# EAGLE board Layer 1 (EAGLE 9.6.2), part 1 of 2
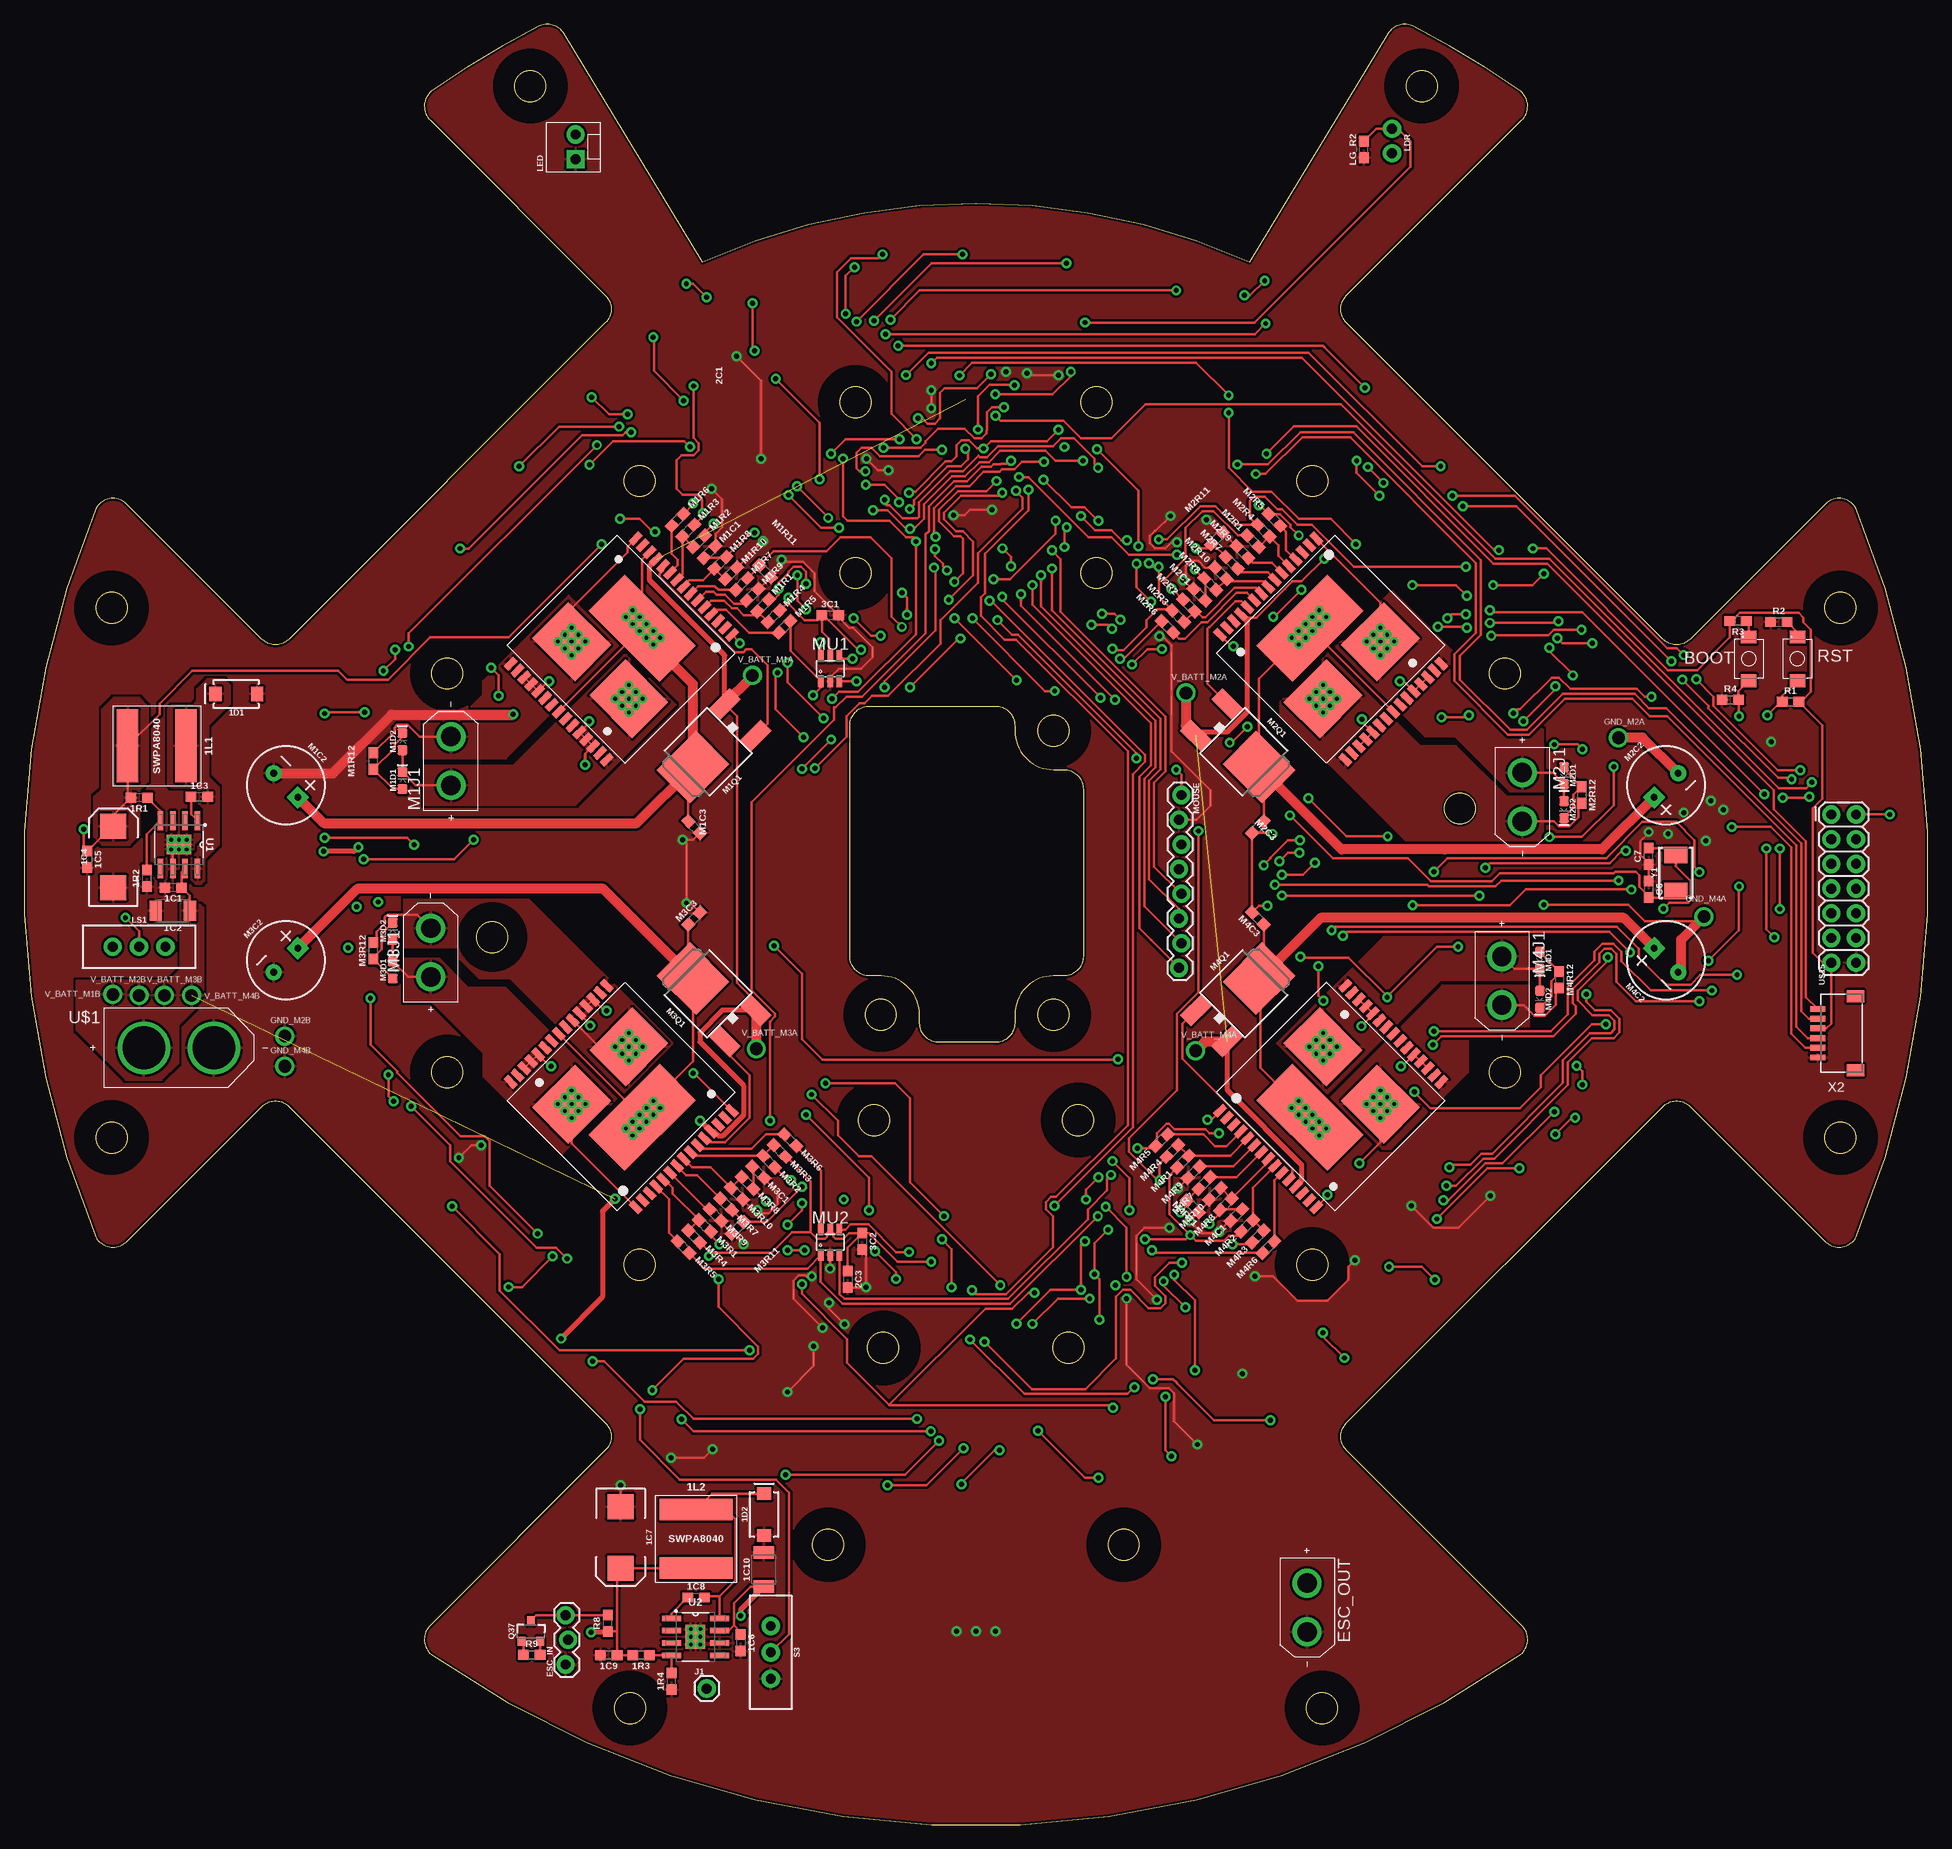
[diagram p5: board, top side]
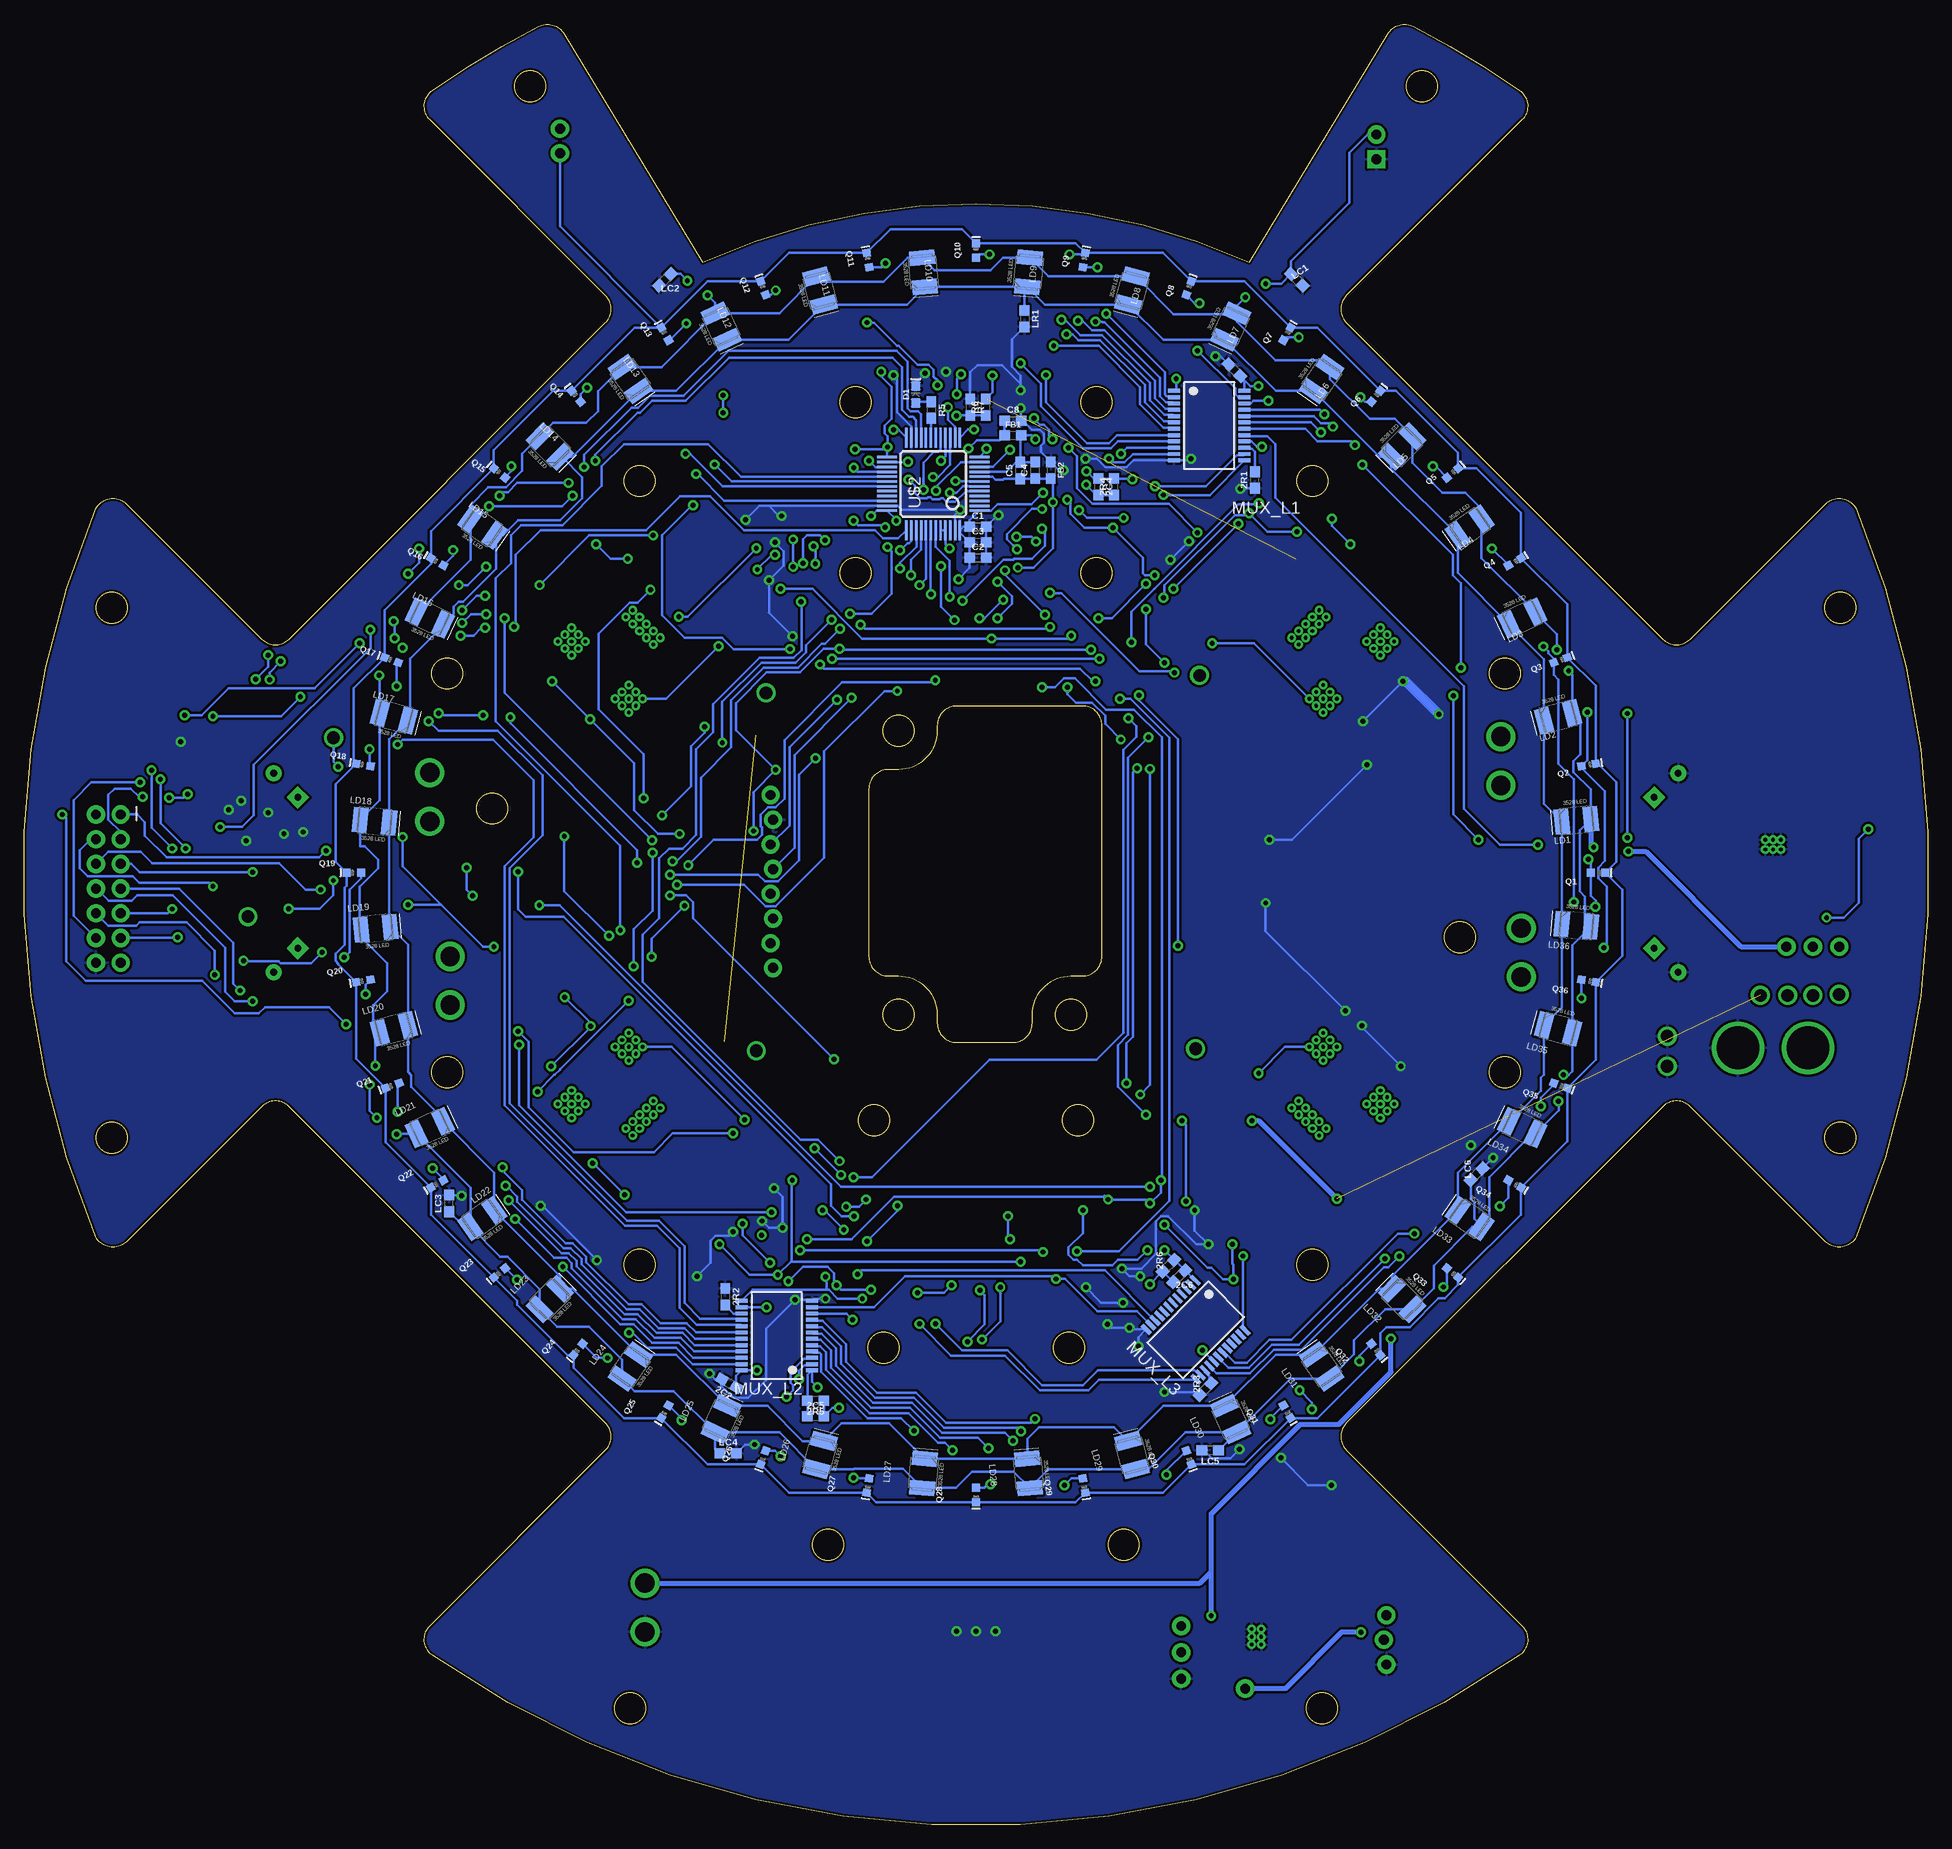
[diagram p6: board, bottom side, seen from below]

Size 195.82 x 185.17 mm. Coordinates in mm from the lower left corner, seen from the top.
Outline: 91 segments
Outline: circle at 186.83,70.65 radius 1.6
Outline: circle at 186.83,125.14 radius 1.6
Outline: circle at 105.9,112.51 radius 1.6
Outline: circle at 105.9,83.3 radius 1.6
Outline: circle at 88.12,83.3 radius 1.6
Outline: circle at 8.99,125.14 radius 1.6
Outline: circle at 8.99,70.65 radius 1.6
Outline: circle at 85.51,146.29 radius 1.6
Outline: circle at 110.31,146.29 radius 1.6
Outline: circle at 63.31,138.2 radius 1.6
Outline: circle at 132.5,138.2 radius 1.6
Outline: circle at 85.51,128.73 radius 1.6
Outline: circle at 110.31,128.73 radius 1.6
Outline: circle at 43.51,118.4 radius 1.6
Outline: circle at 105.9,112.51 radius 1.6
Outline: circle at 152.3,118.4 radius 1.6
Outline: circle at 152.3,77.39 radius 1.6
Outline: circle at 132.5,57.59 radius 1.6
Outline: circle at 87.41,72.45 radius 1.6
Outline: circle at 43.51,77.39 radius 1.6
Copper layers (1*16): Top 0.035mm / dielectric 1.5mm / Bottom 0.035mm
Design rules "SparkFun-2-layer-STANDARD": minimum track width 10mil, minimum drill 20mil, track to track 10mil, track to pad 8mil, pad to pad 8mil, via to via 10mil, smd to smd 8mil, copper to edge 8mil, drill to drill 8mil, minimum pad ring 10mil, minimum via ring 10mil, stop-mask expansion 4mil, vias tented up to drill 25mil, thermal gap 10mil
tRestrict: area 48.6,175.3 to 55.6,182.3; area 140.3,175.3 to 147.3,182.3; area 183.3,121.6 to 190.3,128.6; area 183.3,67.1 to 190.3,74.1; area 5.5,121.6 to 12.5,128.6; area 5.5,67.1 to 12.5,74.1; area 130,8.5 to 137,15.5; area 58.8,8.5 to 65.8,15.5; area 79.2,25.3 to 86.2,32.3; area 109.6,25.3 to 116.6,32.3; area 82,142.8 to 89,149.8; area 106.8,142.8 to 113.8,149.8; 18 more areas

## Footprints (pad centres in the part's own frame; a part is rotated, then mirrored left to right if it is on the bottom)
C0603 = smd 1.1 x 1: 1 -0.85,0; 2 0.85,0
C1210 = smd 1.27 x 2.06: 1 -1.755,0; 2 1.755,0
EIA7343 = smd 2.55 x 2.7: A 3.17,0; C -3.17,0
SMA-DIODE = smd 1.27 x 1.47: A -2.15,0; C 2.15,0
SWPA8040 = smd 2.2 x 7.5: P1 -3,0; P2 3,0
R0603 = smd 1.1 x 1: 1 -0.85,0; 2 0.85,0
MOMENTARY_SWITCH_4X3 = smd 1.3 x 1.6: P$1 -2.25,0; P$2 2.25,0
LED-0603 = smd 1 x 1: A -0.877,0; C 0.877,0
1X03_LOCK = drill 1.016 pad 1.88: 1 0,0.127; 2 2.54,-0.127; 3 5.08,0.127
XT30PB-F = drill 2: + -2.5,0; - 2.5,0
0603 = smd 1.1 x 1: 1 -0.85,0; 2 0.85,0
18AWG = drill 1.3: P$1 0,0
1X01 = drill 1.016 pad 1.88: 1 0,0
3528 = smd 1.5 x 2.6: A -1.5,0; C 1.5,0
1X02_NO_SILK = drill 1.016 pad 1.88: 1 0,0; 2 2.54,0
MOLEX-1X2 = drill 1.016 pad 1.88 square: 1 0,0 | drill 1.016 pad 1.88: 2 2.54,0
SWITCH_SPDT_PTH_11.6X4.0MM_LOCK = drill 1.016 pad 1.88: 1 0,2.718; 2 0,0; 3 0,-2.718
3.5MM_CAP = drill 0.7 pad 1.651 square: 1 1.75,0 | drill 0.7 pad 1.651: 2 -1.75,0
DPAK = smd 1.6 x 3: 1 -2.28,-5.31; 3 2.28,-5.31 | smd 4.826 x 5.715: 4 0,1.588
POWERSO-30 = smd 0.65 x 1.4: P1 -7,-9.1; P2 -6,-9.1; P3 -5,-9.1; P4 -4,-9.1; P5 -3,-9.1; P6 -2,-9.1; P7 -1,-9.1; P8 0,-9.1; P9 1,-9.1; P10 2,-9.1; P11 3,-9.1; P12 4,-9.1; P13 5,-9.1; P14 6,-9.1; P15 7,-9.1; P16 7,9.1; P17 6,9.1; P18 5,9.1; P19 4,9.1; P20 3,9.1; P21 2,9.1; P22 1,9.1; P23 0,9.1; P24 -1,9.1; P25 -2,9.1; P26 -3,9.1; P27 -4,9.1; P28 -5,9.1; P29 -6,9.1; P30 -7,9.1 | drill 0.381: P$1 -4.165,3.05; P$2 -3.165,3.05; P$3 -5.165,3.05; P$4 -5.165,2.05; P$5 -4.165,2.05; P$6 -3.165,2.05; P$7 -5.165,4.05; P$8 -4.165,4.05; P$9 -3.165,4.05; P$10 4.165,3.05; P$11 5.165,3.05; P$12 3.165,3.05; P$13 3.165,2.05; P$14 4.165,2.05; P$15 5.165,2.05; P$16 3.165,4.05; P$17 4.165,4.05; P$18 5.165,4.05; P$19 0,-2.669; P$20 -1,-2.669; P$21 1,-2.669; P$22 -2,-2.669; P$23 2,-2.669; P$24 0,-3.669; P$25 1,-3.669; P$26 2,-3.669; P$27 -1,-3.669; P$28 -2,-3.669 | smd 10.3 x 5.25: SLUG1 0,-3.05 | smd 6.23 x 5.25: SLUG2 -4.165,3.05; SLUG3 4.165,3.05
1X08_LOCK = drill 1.016 pad 1.88: 1 0,0.127; 2 2.54,-0.127; 3 5.08,0.127; 4 7.62,-0.127; 5 10.16,0.127; 6 12.7,-0.127; 7 15.24,0.127; 8 17.78,-0.127
SOT23-6 = smd 0.55 x 1.2: 1 -0.95,-1.3; 2 0,-1.3; 3 0.95,-1.3; 4 0.95,1.3; 5 0,1.3; 6 -0.95,1.3
SSOP24 = smd 0.4 x 1.25: 1 -3.575,-3.625; 2 -2.925,-3.625; 3 -2.275,-3.625; 4 -1.625,-3.625; 5 -0.975,-3.625; 6 -0.325,-3.625; 7 0.325,-3.625; 8 0.975,-3.625; 9 1.625,-3.625; 10 2.275,-3.625; 11 2.925,-3.625; 12 3.575,-3.625; 13 3.575,3.625; 14 2.925,3.625; 15 2.275,3.625; 16 1.625,3.625; 17 0.975,3.625; 18 0.325,3.625; 19 -0.325,3.625; 20 -0.975,3.625; 21 -1.625,3.625; 22 -2.275,3.625; 23 -2.925,3.625; 24 -3.575,3.625
ALS-PT19 = smd 0.8 x 0.8: C -0.75,0; E 0.75,0
SOT23-3 = smd 0.8 x 0.9: 1 -0.95,-1; 2 0.95,-1; 3 0,1.1
POWERPAD-SOIC-8 = smd 1.981 x 0.559: 1 -2.464,1.905; 2 -2.464,0.635; 3 -2.464,-0.635; 4 -2.464,-1.905; 5 2.464,-1.905; 6 2.464,-0.635; 7 2.464,0.635; 8 2.464,1.905 | smd 2.007 x 2.489: 9 0,0 | drill 0.381: P$1 -0.5,0.8; P$2 0.5,0.8; P$3 -0.5,0; P$4 0.5,0; P$5 -0.5,-0.8; P$6 0.5,-0.8
XT60PB-M = drill 4.4: + -3.6,0; - 3.6,0
LQFP48 = smd 0.254 x 2.032: 1 -2.75,-4.758; 2 -2.25,-4.758; 3 -1.75,-4.758; 4 -1.25,-4.758; 5 -0.75,-4.758; 6 -0.25,-4.758; 7 0.25,-4.758; 8 0.75,-4.758; 9 1.25,-4.758; 10 1.75,-4.758; 11 2.25,-4.758; 12 2.75,-4.758; 25 2.75,4.758; 26 2.25,4.758; 27 1.75,4.758; 28 1.25,4.758; 29 0.75,4.758; 30 0.25,4.758; 31 -0.25,4.758; 32 -0.75,4.758; 33 -1.25,4.758; 34 -1.75,4.758; 35 -2.25,4.758; 36 -2.75,4.758 | smd 2.032 x 0.254: 13 4.758,-2.75; 14 4.758,-2.25; 15 4.758,-1.75; 16 4.758,-1.25; 17 4.758,-0.75; 18 4.758,-0.25; 19 4.758,0.25; 20 4.758,0.75; 21 4.758,1.25; 22 4.758,1.75; 23 4.758,2.25; 24 4.758,2.75; 37 -4.758,2.75; 38 -4.758,2.25; 39 -4.758,1.75; 40 -4.758,1.25; 41 -4.758,0.75; 42 -4.758,0.25; 43 -4.758,-0.25; 44 -4.758,-0.75; 45 -4.758,-1.25; 46 -4.758,-1.75; 47 -4.758,-2.25; 48 -4.758,-2.75
2X7 = drill 1.016 pad 1.88: 1 0,0; 2 0,2.54; 3 2.54,0; 4 2.54,2.54; 5 5.08,0; 6 5.08,2.54; 7 7.62,0; 8 7.62,2.54; 9 10.16,0; 10 10.16,2.54; 11 12.7,0; 12 12.7,2.54; 13 15.24,0; 14 15.24,2.54
SM06B-SRSS-TB = smd 0.6 x 1.55: 1 2.5,0; 2 1.5,0; 3 0.5,0; 4 -0.5,0; 5 -1.5,0; 6 -2.5,0 | smd 1.2 x 1.8: M1 3.8,3.875; M2 -3.8,3.875
CRYSTAL-SMD-5X3.2-2PAD = smd 1.7 x 2.4: P$1 1.85,0; P$2 -1.85,0

## Placement (x,y rotation side)
1C1  4.7uF  [C0603]  15.33,96.37 180 top
1C2  22uF  [C1210]  15.28,93.98 180 top
1C3  10nF  [C0603]  18.01,105.73 0 top
1C4  220uF  [EIA7343]  9.16,99.52 90 top
1C5  0.1uF  [C0603]  6.48,99.28 270 top
1C6  4.7uF  [C0603]  73.7,18.69 270 top
1C7  220uF  [EIA7343]  61.35,29.53 270 top
1C8  10nF  [C0603]  69.11,23.36 0 top
1C9  0.1uF  [C0603]  60.13,17.42 180 top
1C10  22uF  [C1210]  76.08,26.23 90 top
1D1  SS54  [SMA-DIODE]  21.81,116.29 180 top
1D2  SS54  [SMA-DIODE]  76.11,31.89 90 top
1L1  10uH  [SWPA8040]  13.63,110.94 180 top
1L2  10uH  [SWPA8040]  69.11,29.39 270 top
1R1  10k  [R0603]  11.81,105.62 180 top
1R2  5.9k  [R0603]  12.62,97.34 90 top
1R3  10k  [R0603]  63.45,17.42 180 top
1R4  3.24k  [R0603]  66.59,14.73 90 top
2C1  0.1uF  [C0603]  71.31,149.59 135 bottom
2C2  0.1uF  [C0603]  123.31,45.39 150 bottom
2C3  0.1uF  [C0603]  84.71,56.09 270 top
2C4  1uF  [C0603]  85.31,137.59 270 bottom
2C5  1uF  [C0603]  114.41,41.99 0 bottom
2C6  1uF  [C0603]  77.01,56.39 225 bottom
2R1  1k  [R0603]  69.21,138.29 90 bottom
2R2  1k  [R0603]  123.71,54.29 270 bottom
2R3  1k  [R0603]  74.31,44.79 45 bottom
2R4  3k  [R0603]  83.71,137.59 90 bottom
2R5  3k  [R0603]  114.41,43.59 180 bottom
2R6  3k  [R0603]  78.11,57.49 45 bottom
3C1  0.1uF  [C0603]  82.91,124.39 0 top
3C2  0.1uF  [C0603]  86.21,59.99 270 top
BOOT  MOMENTARY_SWITCH_4X3  [MOMENTARY_SWITCH_4X3]  177.41,119.89 270 top
C1  1uF  [C0603]  97.71,133.49 0 bottom
C2  1uF  [C0603]  97.71,130.29 0 bottom
C3  1uF  [C0603]  97.71,131.89 0 bottom
C4  10nF  [C0603]  91.81,139.29 90 bottom
C5  1uF  [C0603]  93.35,139.27 90 bottom
C6  22pF  [C0603]  167.11,96.19 270 top
C7  22pF  [C0603]  167.11,99.59 90 top
C8  1uF  [C0603]  94.11,144.39 0 bottom
D1  BLUE  [LED-0603]  104.11,147.09 90 bottom
ESC_IN  [1X03_LOCK]  55.81,16.46 90 top
ESC_OUT  XT30PB-F  [XT30PB-F]  131.97,22.33 270 top
FB1  30Ω/1.8A  [0603]  94.11,142.89 0 bottom
FB2  30Ω/1.8A  [0603]  90.21,139.29 270 bottom
GND_M2A  18AWG  [18AWG]  164.01,111.79 0 top
GND_M2B  18AWG  [18AWG]  26.81,81.09 0 top
GND_M4A  18AWG  [18AWG]  172.81,93.39 0 top
GND_M4B  18AWG  [18AWG]  26.81,77.99 0 top
J1  [1X01]  70.21,13.99 0 top
LC1  1uF  [C0603]  64.91,158.89 315 bottom
LC2  1uF  [C0603]  129.91,158.89 225 bottom
LC3  1uF  [C0603]  152.11,63.89 90 bottom
LC4  1uF  [C0603]  123.41,38.19 0 bottom
LC5  1uF  [C0603]  73.81,38.49 180 bottom
LC6  1uF  [C0603]  46.41,66.89 45 bottom
LD1  3528LED  [3528]  36.14,103.3 185 bottom
LD2  3528LED  [3528]  38.02,113.94 195 bottom
LD3  3528LED  [3528]  41.72,124.1 205 bottom
LD4  3528LED  [3528]  47.12,133.46 215 bottom
LD5  3528LED  [3528]  54.07,141.73 225 bottom
LD6  3528LED  [3528]  62.35,148.68 235 bottom
LD7  3528LED  [3528]  71.71,154.09 245 bottom
LD8  3528LED  [3528]  81.86,157.78 255 bottom
LD9  3528LED  [3528]  92.5,159.66 265 bottom
LD10  3528LED  [3528]  103.31,159.66 275 bottom
LD11  3528LED  [3528]  113.96,157.78 285 bottom
LD12  3528LED  [3528]  124.11,154.09 295 bottom
LD13  3528LED  [3528]  133.47,148.68 305 bottom
LD14  3528LED  [3528]  141.75,141.73 315 bottom
LD15  3528LED  [3528]  148.7,133.46 325 bottom
LD16  3528LED  [3528]  154.1,124.1 335 bottom
LD17  3528LED  [3528]  157.8,113.94 345 bottom
LD18  3528LED  [3528]  159.77,103.2 355 bottom
LD19  3528LED  [3528]  159.67,92.19 5 bottom
LD20  3528LED  [3528]  157.8,81.85 15 bottom
LD21  3528LED  [3528]  154.1,71.69 25 bottom
LD22  3528LED  [3528]  148.7,62.33 35 bottom
LD23  3528LED  [3528]  141.75,54.05 45 bottom
LD24  3528LED  [3528]  133.47,47.11 55 bottom
LD25  3528LED  [3528]  124.11,41.7 65 bottom
LD26  3528LED  [3528]  113.96,38.01 75 bottom
LD27  3528LED  [3528]  103.31,36.13 85 bottom
LD28  3528LED  [3528]  92.5,36.13 95 bottom
LD29  3528LED  [3528]  81.86,38.01 105 bottom
LD30  3528LED  [3528]  71.71,41.7 115 bottom
LD31  3528LED  [3528]  62.35,47.11 125 bottom
LD32  3528LED  [3528]  54.07,54.05 135 bottom
LD33  3528LED  [3528]  47.12,62.33 145 bottom
LD34  3528LED  [3528]  41.72,71.69 155 bottom
LD35  3528LED  [3528]  38.02,81.85 165 bottom
LD36  3528LED  [3528]  36.14,92.49 175 bottom
LDR  [1X02_NO_SILK]  140.71,171.89 90 top
LED  [MOLEX-1X2]  56.71,171.29 90 top
LG_R2  2k  [R0603]  137.81,172.29 90 top
LR1  47  [R0603]  92.91,154.89 270 bottom
LS1  [SWITCH_SPDT_PTH_11.6X4.0MM_LOCK]  11.81,90.29 270 top
M1C1  33nF  [C0603]  70.51,130.89 45 top
M1C2  680uF  [3.5MM_CAP]  26.91,106.89 315 top
M1C3  1.0uF  [C0603]  68.91,102.59 315 top
M1D1  RED  [LED-0603]  38.91,107.39 90 top
M1D2  BLUE  [LED-0603]  38.91,111.39 90 top
M1J1  XT30PB-F  [XT30PB-F]  43.91,109.39 90 top
M1Q1  AOD482  [DPAK]  69.91,109.89 135 top
M1R1  1k  [R0603]  76.01,125.39 225 top
M1R2  1k  [R0603]  69.41,131.99 225 top
M1R3  3.3k  [R0603]  68.31,133.09 45 top
M1R4  3.3k  [R0603]  77.11,124.29 45 top
M1R5  1k  [R0603]  78.21,123.19 225 top
M1R6  1k  [R0603]  67.21,134.19 225 top
M1R7  1k  [R0603]  73.81,127.59 225 top
M1R8  10k  [R0603]  71.61,129.79 225 top
M1R9  10k  [R0603]  74.91,126.49 225 top
M1R10  1k  [R0603]  72.71,128.69 225 top
M1R11  10k  [R0603]  76.21,128.89 135 top
M1R12  4.7k  [R0603]  35.91,109.39 90 top
M2C1  33nF  [C0603]  120.91,126.49 135 top
M2C2  680uF  [3.5MM_CAP]  168.91,106.89 225 top
M2C3  1.0uF  [C0603]  126.91,102.59 225 top
M2D1  RED  [LED-0603]  158.41,107.89 270 top
M2D2  BLUE  [LED-0603]  158.41,104.39 270 top
M2J1  XT30PB-F  [XT30PB-F]  154.11,105.69 270 top
M2Q1  AOD482  [DPAK]  125.91,109.89 225 top
M2R1  1k  [R0603]  126.41,131.99 315 top
M2R2  1k  [R0603]  119.81,125.39 315 top
M2R3  3.3k  [R0603]  118.71,124.29 135 top
M2R4  3.3k  [R0603]  127.51,133.09 135 top
M2R5  1k  [R0603]  128.61,134.19 315 top
M2R6  1k  [R0603]  117.61,123.19 315 top
M2R7  1k  [R0603]  124.21,129.79 315 top
M2R8  10k  [R0603]  122.01,127.59 315 top
M2R9  10k  [R0603]  125.31,130.89 315 top
M2R10  1k  [R0603]  123.11,128.69 315 top
M2R11  10k  [R0603]  122.71,132.29 225 top
M2R12  4.7k  [R0603]  160.21,105.89 270 top
M3C1  33nF  [C0603]  75.51,67.09 315 top
M3C2  680uF  [3.5MM_CAP]  26.91,88.89 45 top
M3C3  1.0uF  [C0603]  68.91,93.19 45 top
M3D1  RED  [LED-0603]  37.91,87.89 90 top
M3D2  BLUE  [LED-0603]  37.91,91.89 90 top
M3J1  XT30PB-F  [XT30PB-F]  41.81,89.69 90 top
M3Q1  AOD482  [DPAK]  69.91,85.89 45 top
M3R1  1k  [R0603]  70.01,61.59 135 top
M3R2  1k  [R0603]  76.61,68.19 135 top
M3R3  3.3k  [R0603]  77.71,69.29 315 top
M3R4  3.3k  [R0603]  68.91,60.49 315 top
M3R5  1k  [R0603]  67.81,59.39 135 top
M3R6  1k  [R0603]  78.81,70.39 135 top
M3R7  1k  [R0603]  72.21,63.79 135 top
M3R8  10k  [R0603]  74.41,65.99 135 top
M3R9  10k  [R0603]  71.11,62.69 135 top
M3R10  1k  [R0603]  73.31,64.89 135 top
M3R11  10k  [R0603]  73.41,61.39 45 top
M3R12  4.7k  [R0603]  35.91,89.89 90 top
M4C1  33nF  [C0603]  124.71,62.69 225 top
M4C2  680uF  [3.5MM_CAP]  168.91,88.89 135 top
M4C3  1.0uF  [C0603]  126.91,93.19 135 top
M4D1  RED  [LED-0603]  155.91,88.89 270 top
M4D2  BLUE  [LED-0603]  155.91,84.89 270 top
M4J1  XT30PB-F  [XT30PB-F]  152.01,86.79 270 top
M4Q1  AOD482  [DPAK]  125.91,85.89 315 top
M4R1  1k  [R0603]  119.21,68.19 45 top
M4R2  1k  [R0603]  125.81,61.59 45 top
M4R3  3.3k  [R0603]  126.91,60.49 225 top
M4R4  3.3k  [R0603]  118.11,69.29 225 top
M4R5  1k  [R0603]  117.01,70.39 45 top
M4R6  1k  [R0603]  128.01,59.39 45 top
M4R7  1k  [R0603]  121.41,65.99 45 top
M4R8  10k  [R0603]  123.61,63.79 45 top
M4R9  10k  [R0603]  120.31,67.09 45 top
M4R10  1k  [R0603]  122.51,64.89 45 top
M4R11  10k  [R0603]  120.21,63.59 135 top
M4R12  4.7k  [R0603]  157.91,86.89 270 top
M_BL  VNH5019  [POWERSO-30]  61.41,74.89 45 top
M_BR  VNH5019  [POWERSO-30]  134.41,74.89 315 top
M_FL  VNH5019  [POWERSO-30]  61.41,120.89 135 top
M_FR  VNH5019  [POWERSO-30]  134.41,120.89 225 top
MOUSE  [1X08_LOCK]  118.91,105.89 270 top
MU1  [SOT23-6]  82.91,118.89 0 top
MU2  [SOT23-6]  82.91,59.89 0 top
MUX_L1  [SSOP24]  73.91,143.89 270 bottom
MUX_L2  [SSOP24]  118.41,50.29 90 bottom
MUX_L3  [SSOP24]  75.31,50.89 225 bottom
Q1  [ALS-PT19]  33.91,97.89 180 bottom
Q2  [ALS-PT19]  34.88,109.01 190 bottom
Q3  [ALS-PT19]  37.77,119.78 200 bottom
Q4  [ALS-PT19]  42.48,129.89 210 bottom
Q5  [ALS-PT19]  48.88,139.03 220 bottom
Q6  [ALS-PT19]  56.77,146.92 230 bottom
Q7  [ALS-PT19]  65.91,153.32 240 bottom
Q8  [ALS-PT19]  76.02,158.03 250 bottom
Q9  [ALS-PT19]  86.79,160.92 260 bottom
Q10  [ALS-PT19]  97.91,161.89 270 bottom
Q11  [ALS-PT19]  109.02,160.92 280 bottom
Q12  [ALS-PT19]  119.8,158.03 290 bottom
Q13  [ALS-PT19]  129.91,153.32 300 bottom
Q14  [ALS-PT19]  139.05,146.92 310 bottom
Q15  [ALS-PT19]  146.94,139.03 320 bottom
Q16  [ALS-PT19]  153.33,129.89 330 bottom
Q17  [ALS-PT19]  158.05,119.78 340 bottom
Q18  [ALS-PT19]  160.94,109.01 350 bottom
Q19  [ALS-PT19]  161.91,97.89 0 bottom
Q20  [ALS-PT19]  160.94,86.78 10 bottom
Q21  [ALS-PT19]  157.95,76 20 bottom
Q22  [ALS-PT19]  153.33,65.89 30 bottom
Q23  [ALS-PT19]  146.94,56.76 40 bottom
Q24  [ALS-PT19]  138.85,48.87 50 bottom
Q25  [ALS-PT19]  129.91,42.47 60 bottom
Q26  [ALS-PT19]  119.8,37.75 70 bottom
Q27  [ALS-PT19]  109.02,34.87 80 bottom
Q28  [ALS-PT19]  97.91,33.89 90 bottom
Q29  [ALS-PT19]  86.79,34.87 100 bottom
Q30  [ALS-PT19]  76.02,37.75 110 bottom
Q31  [ALS-PT19]  65.91,42.47 120 bottom
Q32  [ALS-PT19]  56.77,48.87 130 bottom
Q33  [ALS-PT19]  48.88,56.76 140 bottom
Q34  [ALS-PT19]  42.48,65.89 150 bottom
Q35  [ALS-PT19]  37.77,76 160 bottom
Q36  [ALS-PT19]  34.88,86.78 170 bottom
Q37  AO3402  [SOT23-3]  52.11,19.86 0 top
R1  10k  [R0603]  181.71,115.49 0 top
R2  1k  [R0603]  180.51,123.69 0 top
R3  1k  [R0603]  176.31,123.79 180 top
R4  10k  [R0603]  175.51,115.69 0 top
R5  470  [R0603]  102.51,145.49 270 bottom
R6  2M  [R0603]  96.91,145.79 90 bottom
R7  500k  [R0603]  98.51,145.79 270 bottom
R8  4.7k  [R0603]  60.03,20.71 90 top
R9  4.7k  [R0603]  52.21,17.46 0 top
RST  MOMENTARY_SWITCH_4X3  [MOMENTARY_SWITCH_4X3]  182.41,119.89 270 top
S3  [SWITCH_SPDT_PTH_11.6X4.0MM_LOCK]  76.8,17.71 180 top
U1  [POWERPAD-SOIC-8]  15.91,100.79 270 top
U2  [POWERPAD-SOIC-8]  69.06,19.31 0 top
U$1  XT60XT60PB-M  [XT60PB-M]  15.91,79.89 0 top
U$2  STM32F103CBT6  [LQFP48]  102.31,137.89 90 bottom
U$15  CONN_07X2  [2X7]  185.91,103.89 270 top
V_BATT_M1A  18AWG  [18AWG]  74.91,118.19 0 top
V_BATT_M1B  18AWG  [18AWG]  9.11,85.39 0 top
V_BATT_M2A  18AWG  [18AWG]  119.51,116.39 0 top
V_BATT_M2B  18AWG  [18AWG]  11.81,85.29 0 top
V_BATT_M3A  18AWG  [18AWG]  75.31,79.79 0 top
V_BATT_M3B  18AWG  [18AWG]  14.41,85.29 0 top
V_BATT_M4A  18AWG  [18AWG]  120.51,79.59 0 top
V_BATT_M4B  18AWG  [18AWG]  17.21,85.29 0 top
X2  SM06B-SRSS-TB  [SM06B-SRSS-TB]  184.51,81.39 270 top
Y1  8MHz  [CRYSTAL-SMD-5X3.2-2PAD]  169.91,97.89 90 top

## Tracks (layer width: path | path; a pad name or v marks a point on that pad's centre or on a via)
3.3V  (via drill 0.51)
  Top 0.254: 80.91,60.9 81.55,60.26 82.37,60.26 82.56,60.46 82.56,60.85 MU2.5 83.25,60.85 83.25,60.46 83.45,60.26 84.27,60.26 84.85,60.84 3C2.1 | 80.91,60.9 80.91,66.19 78.41,68.69 M3R3.2 | M1R3.2 69.81,134.59 v69.81,134.89 69.71,134.99 69.71,136.25 69.18,136.78 67.72,136.78 67.13,137.37 67.13,140.35 67.61,140.83 68.85,140.83 69.37,141.35 69.37,142.09 68.84,142.63 v68.84,147.96 | M1R4.2 78.61,125.79 v78.61,126.19 78.61,125.54 80.26,123.89 81.56,123.89 3C1.1 82.06,124.29 | 82.06,124.29 82.06,122.7 82.8,121.96 82.8,120.31 MU1.5 | v6.11,102.39 6.11,100.51 1C5.1 9.04,102.69 1C4.A 9.16,103.81 1R1.2 10.63,105.95 1L1.P2 13.91,114.22 13.91,115.29 17.29,118.67 32.31,118.67 33.21,117.77 37.41,117.77 41.74,122.1 49.82,122.1 v59.41,131.69 | 82.06,124.29 82.34,124.29 85.93,120.7 v86.07,120.83 | 113.08,120.78 115.43,123.14 115.43,123.87 116.56,125 118.01,125 M2R3.2 116.71,126.29 v116.71,129.39 116.04,129.39 v115.71,129.72 | LS1.2 11.81,91.89 v10.41,93.29 | v111.96,120.94 112.12,120.78 113.08,120.78 | 2C3.1 84.71,59.34 3C2.1 | 3C2.1 86.91,60.84 89.85,57.9 v93.31,57.9 | M4R4.2 116.81,67.99 v116.81,66.28 116.56,66.28 113.64,69.2 113.64,70.61 118.59,75.55 118.59,83.39 120.81,85.62 v120.81,102.19 | M4R3.2 126.1,59.68 v124.31,59.68 | M3R4.2 70.42,58.98 v70.42,58.48 70.75,58.81 76.88,58.81 78.97,60.9 80.91,60.9 | v61.31,134.32 63.31,134.32 64.64,132.99 v64.91,132.99 | v120.42,46.72 120.42,53.94 118.3,56.06 v118.3,56.55 | v106.11,134.09 106.11,132.79 101.41,128.09 v99.72,128.09 | v116.71,132.18 117.58,132.18 121,135.6 122.57,135.6 124.47,133.7 M2R4.2 126.81,133.7 126.11,134.39 126.11,136.15 126.54,136.58 127.62,136.58 128.9,135.3 129.39,135.3 131,133.7 132.49,133.7 136.79,129.39 v148.31,129.39
  Top 0.254: v155.19,131.25 156.57,131.25 169.07,118.75 172.11,118.75 175.46,122.1 R3.2 175.64,123.79 176.47,124.62 182.55,124.62 183.04,124.13 183.04,123.66 183.81,122.89 183.81,116.49 182.81,115.49 R1.2 185,113.06 185,105.53 184.01,104.54 184.01,89.69 185.05,88.65 U$15.13 185.91,82.39 185.41,81.89 X2.4 | v156.31,128.64 155.16,127.49 v151.11,127.49 | v118.51,108.49 119.04,107.97 MOUSE.1 | v113.42,132.11 112.89,132.11 111.85,133.14 110.16,133.14 v108.71,134.59 | 113.08,120.78 | v106.41,143.47 105.24,142.3 99.43,142.3 v98.67,141.54 98.02,141.54 97.18,142.38 96.44,142.38 95.92,141.86 95.92,140.72 95.41,140.21 94.79,140.21 91.67,137.09 91.11,137.09 v91.01,136.99
  Bottom 0.254: v78.61,126.19 78.5,126.31 78.5,127.46 71.28,134.68 70.02,134.68 v69.81,134.89 67.91,132.99 v64.91,132.99 | v6.11,102.39 7.11,101.39 7.11,94.79 8.61,93.29 v10.41,93.29 | MUX_L1.24 70.31,147.49 70.31,148.29 70.71,148.69 2C1.1 69.68,147.96 v68.84,147.96 | v86.07,120.83 111.85,120.83 v111.96,120.94 113.59,120.94 116.03,118.5 119.44,118.5 122.6,115.35 122.6,112.58 v118.51,108.49 120.81,106.19 v120.81,102.19 | 2C2.1 122.57,46.18 MUX_L2.24 v120.42,46.72 | v118.3,56.55 116.91,57.94 116.91,66.18 v116.81,66.28 | v124.31,59.68 121.19,56.56 v118.3,56.56 v118.3,56.55 | v70.42,58.48 70.42,51.07 MUX_L3.24 | v59.41,131.69 61.31,133.59 v61.31,134.32 | C8.1 FB1.1 95.47,142.38 97.83,142.38 v98.67,141.54 | v106.11,134.09 106.11,134.19 U$2.36 108.16,135.14 v108.71,134.59 | v116.71,132.18 v116.71,129.39 | v155.19,131.25 155.19,129.77 v156.31,128.64 | v151.11,127.49 150.21,127.49 v148.31,129.39 | v99.72,128.09 98.56,129.26 C2.1 C3.1 99.56,132.89 U$2.48 99.2,133.49 C1.1 98.56,134.14 U$2.1 96.38,135.14 95.7,135.82 92.18,135.82 v91.01,136.99 | v106.41,143.47 105.88,143.47 U$2.24 | v115.71,129.72 115.71,132.23 115.31,132.63 113.94,132.63 v113.42,132.11 | v93.31,57.9 116.95,57.9 v118.3,56.55
  pour Bottom: 98.81,134.49 99.81,134.49 99.81,131.49 99.81,129.19 99.41,128.79 98.21,128.79 97.81,129.19 97.81,133.89 97.81,134.29 98.01,134.49
  pour Top: 8.01,100.79 10.81,100.79 11.81,101.79 11.81,106.39 12.71,107.29 12.71,114.99 11.81,115.89 9.21,115.89 8.01,114.69 8.01,106.49 7.21,105.69 7.21,101.59
3.3V1
  Top 0.254: Q37.1 51.36,18.66 R9.1
5V  (via drill 0.51)
  Top 0.254: 1L2.P2 69.08,26.36 1C7.A 60.98,25.99 60.98,19.89 | 1R3.2 1C9.1 60.98,19.89 | R8.1 60.06,19.89 60.98,19.89
  Top 0.508: R8.1 59.96,19.79 v58.31,19.79
  Bottom 0.508: v58.31,19.79 60.3,19.79 66.1,13.99 J1.1
AGND  (via drill 0.51)
  Top 0.254: v80.01,55.59 80.01,54.59 84.66,49.95 84.66,47.5 88.99,43.17 | v112.01,42.89 111.78,43.12 89.03,43.12 88.99,43.17 | 88.99,43.17 98.86,53.05 101.64,53.05 103.28,54.69 v103.91,54.69 | v100.41,55.49 87.16,68.75 85.87,68.75 83.71,70.92 83.71,72.4 v81.01,75.09 | v88.51,116.99 88.51,117.62 93.73,122.84 93.73,129.18 v93.61,129.29 | v86.57,137.82 88.48,137.82 90.01,136.29 v90.01,135.99 | v83.02,111.61 v83.02,111.6 80.01,108.59 v80.01,108.58
  Bottom 0.254: 2R4.1 2C4.2 85.5,136.74 v86.57,137.82 | 2C6.2 2R6.1 v80.01,55.59 | 2R5.1 2C5.2 112.66,42.89 v112.01,42.89 | U$2.8 96.22,138.64 95.88,138.31 95.14,138.31 95.02,138.42 C5.1 93.33,138.44 C4.1 FB2.2 90.01,138.24 v90.01,135.99 90.01,131.29 92.01,129.29 v93.61,129.29 | v103.91,54.69 101.21,54.69 v100.41,55.49 | v83.02,111.61 84.61,113.2 84.61,114.03 85.96,115.38 87.61,115.38 88.51,116.28 v88.51,116.99 | v80.01,108.58 80.01,76.09 v81.01,75.09
BATT_LVL  (via drill 0.51)
  Top 0.254: v99.91,144.89 100.42,144.38 106.93,144.38 108.72,142.59 111.84,142.59 115.35,146.09 135.45,146.09 151.34,130.21 156.9,130.21 180.51,106.59 183.31,106.59 v183.91,107.19
  Bottom 0.254: v99.91,144.89 99.86,144.94 R7.2 R6.1 | v183.91,107.19 188.91,107.19 190.73,105.38 190.73,93.47 U$15.12
BL_CS  (via drill 0.51)
  Top 0.254: M3C1.1 75.01,67.59 M3R8.1 v76.31,64.09 | v76.31,64.09 | v76.71,72.39 76.71,82.6 77.23,83.12 77.23,83.39 74.82,85.81 74.82,105.15 83.31,113.64 83.31,114.91 83.48,114.91 84.57,116 86.17,116 92.72,122.55 92.72,132.71 93.06,133.05 93.06,135.61 95.63,138.18 97.01,138.18 98.46,139.64 99.46,139.64 99.72,139.89 100.41,139.89 100.51,139.99 101.21,139.99 v101.51,140.29
  Bottom 0.254: v76.31,64.09 76.31,71.99 v76.71,72.39 | v101.51,140.29 101.06,140.74 U$2.16
BL_DIR  (via drill 0.51)
  Top 0.254: M3R5.1 70.01,57.19 80.56,57.19 MU2.1 81.9,58.54 81.9,55.81 84.16,53.56 101.43,53.56 v110.44,62.57 | v145.01,97.99 146.41,99.4 162.75,99.4 166.47,103.12 169.94,103.12 171.8,101.26 171.8,98.49 v172.32,97.97
  Bottom 0.254: v110.44,62.57 111.74,62.57 112.81,63.64 112.81,65.88 140.32,93.39 144.24,93.39 145.01,94.15 v145.01,97.99 | v172.32,97.97 183.97,97.97 184.81,98.81 U$15.5
BL_OUTA
  Top 0.254: M3J1.+ 39.49,87.19 M3D1.C M3D2.A | M_BL.P1 56.31,70.1 M_BL.P$4 M_BL.SLUG2 | M_BL.SLUG2 M_BL.P$3 | M_BL.SLUG2 M_BL.P$7 | M_BL.SLUG2 M_BL.P$8 | M_BL.SLUG2 M_BL.P$2 | M_BL.P$2 | M_BL.SLUG2 M_BL.P$6 | M_BL.SLUG2 | M_BL.SLUG2 M_BL.P$5 | M_BL.SLUG2 M_BL.P$9
  pour Top: 39.01,89.09 42.66,89.09 45.63,86.12 49.47,86.12 60.95,74.64 55.31,68.99 55.31,68.89 47.21,76.99 47.21,79.39 42.01,84.59 39.01,84.59
BL_OUTB  (via drill 0.51)
  Top 0.254: M3R12.2 36.23,91.07 36.23,91.81 37.08,92.66 37.08,93.32 37.36,93.6 40.4,93.6 M3J1.- | M_BL.P21 59.14,80 M_BL.P$10 | M_BL.P15 72.77,73.41 68.9,77.28 v68.82,77.28 | M_BL.P$10 M_BL.P$17 | M_BL.P$10 M_BL.P$18 | M_BL.P$10 M_BL.P$11 | M_BL.P$10 M_BL.P$15 | M_BL.P$10 M_BL.P$14 | M_BL.P$14 | M_BL.P$10 M_BL.P$13 | M_BL.P$10 | M_BL.P$10 M_BL.P$12 | M_BL.P$10 M_BL.P$16
  Bottom 0.254: v68.82,77.28 66.11,80 M_BL.P$15
  pour Top: 39.01,90.19 44.61,90.19 44.61,89.22 46.84,86.99 50.01,86.99 61.71,75.29 66.71,80.29 66.71,80.39 51.91,95.19 39.01,95.19
BL_PWM  (via drill 0.51)
  Top 0.254: M3R7.1 M3R11.2 76.41,62 v80.01,65.59 | v142.83,94.54 152.82,94.54 154.47,96.19 165.3,96.19 v165.32,96.17
  Bottom 0.254: v80.01,65.59 111.81,65.59 140.76,94.54 v142.83,94.54 | U$15.6 187.18,100.08 183.86,100.08 182.66,98.88 169.6,98.88 166.89,96.17 v165.32,96.17
BOOT0  (via drill 0.51)
  Top 0.254: BOOT.P$2 176.36,116.59 R4.2 176.41,115.64 v176.41,113.99 | v100.63,131.26 101.5,130.39 v101.5,129.44 | v100.11,123.89 101.61,122.39 102.23,122.39 114.42,110.21 v114.42,109.67 | v145.81,113.89 148.41,113.89 v148.61,114.09 | v153.21,114.29 153.61,114.7 153.85,114.7 157.14,117.98 157.88,117.98 159.04,116.82 165.88,116.82 166.71,115.99 v167.41,115.99 | v129.4,97.7 131.55,97.7 v132.77,98.92
  Bottom 0.254: U$2.44 U$2.45 101.06,131.68 v100.63,131.26 | v101.5,129.44 101.5,125.28 v100.11,123.89 | v114.42,109.67 116.09,108 116.09,99.17 118.26,97 119.62,97 120.32,97.7 v129.4,97.7 | v148.61,114.09 153.01,114.09 v153.21,114.29 | v167.41,115.99 169.41,113.99 v176.41,113.99 | v132.77,98.92 132.77,100.23 145.81,113.27 v145.81,113.89
BR_CS  (via drill 0.51)
  Top 0.254: M4C1.1 123.11,63.3 M4R8.1 123.01,62.89 v121.91,61.79 | v119.11,57.79 117.8,57.79 116.32,56.31 116.32,55.44 117.4,54.36 117.4,53.63 116.88,53.11 115.67,53.11 113.78,55 113.04,55 112.32,54.28 112.32,47.95 109.17,44.8 103.66,44.8 v98.79,49.67 | v103.31,137.29 103.31,135.19 98.83,130.71 98.83,126.67 98.42,126.26 98.42,124.33 100.86,121.89 102.02,121.89 113.53,110.38 113.53,71.93 106.15,64.55 105.61,64.55 105.09,64.03 105.09,63.3 105.82,62.57 105.82,59.38 101.01,54.57 97.89,54.57 v97.51,54.95
  Bottom 0.254: v121.91,61.79 121.91,60.59 v119.11,57.79 | v98.79,49.67 97.01,51.45 97.01,54.45 v97.51,54.95 | U$2.17 101.56,141.44 101.81,141.19 102.21,141.19 103.31,140.09 v103.31,137.29
BR_DIR  (via drill 0.51)
  Top 0.254: MU2.3 83.88,58.57 83.88,54.56 84.37,54.06 101.22,54.06 109.41,62.26 109.41,63.24 111.4,65.23 111.4,66.44 v111.78,66.82 | v122.91,71.09 121.93,71.09 121.52,71.5 118.35,71.5 117.78,72.07 117.51,72.07 116.54,71.1 116.54,69.92 M4R5.1 116.19,69.57 v114.53,69.57 | v173.61,85.79 167.33,85.79 164.31,88.82 164.31,89.77 163.49,90.59 162.33,90.59 161.51,89.77 161.51,88.89 158.8,86.18 158.8,83.33 157.07,81.6 145.01,81.6 v145,81.61
  Bottom 0.254: v122.91,71.09 129.11,71.09 131.03,69.17 139.29,69.17 143.91,73.8 143.91,80.52 v145,81.61 | v114.53,69.57 v111.78,66.82 | v173.61,85.79 174.31,86.49 174.31,90.69 179.89,96.27 U$15.7
BR_OUTA  (via drill 0.51)
  Top 0.254: M4D2.A M4D1.C 153.29,88.02 M4J1.+ | M_BR.P1 122.11,72.49 v121.71,72.49 | M_BR.SLUG2 M_BR.P$8 | M_BR.SLUG2 M_BR.P$7 | M_BR.SLUG2 M_BR.P$3 | M_BR.SLUG2 M_BR.P$5 | M_BR.P$5 | M_BR.SLUG2 M_BR.P$6 | M_BR.SLUG2 | M_BR.SLUG2 M_BR.P$2 | M_BR.SLUG2 M_BR.P$4 | M_BR.SLUG2 M_BR.P$9
  Bottom 0.254: v121.71,72.49 129.21,80 M_BR.P$4
  pour Top: 154.81,91.29 154.81,86.88 145.75,86.88 134.05,75.18 128.91,80.32 128.91,80.39 139.81,91.29
BR_OUTB  (via drill 0.51)
  Top 0.254: M4R12.2 157.59,85.72 157.59,84.32 156.46,83.19 155.36,83.19 154.25,84.29 M4J1.- | M_BR.P15 134.07,64.66 v134.07,64.78 | v137.34,68.02 139.51,70.2 M_BR.P$15 M_BR.P$10 | M_BR.P$10 M_BR.P$17 | M_BR.P$10 M_BR.P$12 | M_BR.P$10 M_BR.P$13 | M_BR.P$10 | M_BR.P$10 M_BR.P$14 | M_BR.P$10 M_BR.P$11 | M_BR.P$10 M_BR.P$18 | M_BR.P$10 M_BR.P$16
  Bottom 0.254: v134.07,64.78 137.31,68.02 v137.34,68.02
  pour Top: 134.41,74.79 139.71,69.49 140.61,69.49 148.51,77.39 148.51,81.29 149.31,82.09 154.81,82.09 154.81,86.29 145.91,86.29
BR_PWM  (via drill 0.51)
  Top 0.254: M4R7.1 M4R11.2 119.61,63.68 v118.92,62.99 | v144.91,80.19 145.81,81.09 157.28,81.09 159.6,83.41 159.6,84.19 159.31,84.47 159.31,85.97 162.02,88.68 162.02,89.56 162.54,90.08 163.28,90.08 163.8,89.56 163.8,86.71 165.81,84.69 v172.31,84.69
  Bottom 0.254: v118.92,62.99 133.91,62.99 144.91,73.99 v144.91,80.19 | v172.31,84.69 172.32,84.71 174.18,84.71 175.14,85.67 175.14,90.17 180.53,95.56 184.22,95.56 184.78,95 187.13,95 188.4,96.27 U$15.8
ESC_HV
  Top 0.254: R8.2 60,21.53 55.69,21.53 | 55.69,21.53 ESC_IN.3 | Q37.3 52.68,21.53 55.69,21.53
ESC_LV
  Top 0.254: R9.2 Q37.2
FL_CS  (via drill 0.51)
  Top 0.254: M1C1.1 72.11,130.29 M1R8.1 74.71,132.89 v75.11,132.89 | v100.81,145.79 100.8,145.78 99.54,145.78 99.02,145.26 99.02,143.39 99,143.37 99,143.13 98.45,142.58 98.43,142.61 97.74,142.61 96.75,143.59 94,143.59 92.7,142.29 92.7,142.13 92.18,141.61 v88.4,141.61
  Bottom 0.254: v75.11,132.89 78.08,135.86 85.95,135.86 87.52,137.44 87.52,140.73 v88.4,141.61 | v100.81,145.79 100.81,144.51 100.06,143.76 U$2.14
FL_DIR  (via drill 0.51)
  Top 0.254: M1R5.1 78.81,120.74 MU1.1 81.96,117 v81.13,116.17 | v77.12,90.39 80.01,87.51 80.01,80.79 82.12,78.68 112.48,78.68 v112.53,78.73 | v149.68,95.55 129.38,95.55 v129.37,95.56 | v150.3,98.41 150.78,98.89 163.1,98.89 164.38,100.17 v164.78,100.17
  Bottom 0.254: v81.13,116.17 81.13,115.63 77.12,111.62 v77.12,90.39 | v112.53,78.73 127.02,93.23 127.02,94.86 127.72,95.56 v129.37,95.56 | v164.78,100.17 165.48,99.47 181.19,99.47 183.41,101.69 183.41,103.09 184.21,103.89 U$15.1 | v150.3,98.41 150.3,96.18 v149.68,95.55
FL_OUTA  (via drill 0.51)
  Top 0.254: M1J1.+ 40.29,106.89 M1D1.C M1D2.A | M_FL.P1 73.61,121.56 v73.61,121.49 | M_FL.SLUG2 M_FL.P$6 | M_FL.SLUG2 M_FL.P$2 | M_FL.P$2 | M_FL.SLUG2 M_FL.P$9 | M_FL.SLUG2 M_FL.P$8 | M_FL.SLUG2 M_FL.P$3 | M_FL.SLUG2 M_FL.P$4 | M_FL.SLUG2 M_FL.P$5 | M_FL.P$5 | M_FL.SLUG2 M_FL.P$7
  Bottom 0.254: v73.61,121.49 69.31,121.49 M_FL.P$4
  pour Top: 41.15,108.89 41.15,104.89 56.71,104.89 67.01,115.19 61.91,120.29 61.71,120.29 50.31,108.89
FL_OUTB
  Top 0.254: M1R12.2 38.08,112.41 38.08,112.82 38.36,113.1 39.46,113.1 40.66,111.89 M1J1.- | M_FL.P15 62.06,131.44 62.06,130.84 56.31,125.09 M_FL.P$10 | M_FL.P$10 M_FL.P$11 | M_FL.P$10 M_FL.P$13 | M_FL.P$10 | M_FL.P$10 M_FL.P$12 | M_FL.P$10 M_FL.P$14 | M_FL.P$14 | M_FL.P$10 M_FL.P$18 | M_FL.P$10 M_FL.P$17 | M_FL.P$10 M_FL.P$16 | M_FL.P$10 M_FL.P$15
  pour Top: 41.11,109.69 49.53,109.69 61.12,121.28 56.01,126.39 47.21,117.59 47.21,116.19 45.51,114.49 41.21,114.49 41.11,114.39
FL_PWM  (via drill 0.51)
  Top 0.254: M1R7.1 75.61,129.39 M1R11.2 77.11,131 82.53,131 83.97,132.44 87.04,132.44 89.21,130.27 89.21,124.25 v90.28,123.18 | v109.78,123.42 111.48,123.42 v111.89,123.02 | v129.11,99.09 129.99,99.97 v131.19,99.97 | v162.7,82.31 161.27,82.31 156.01,77.05 156.01,75.86 153.84,73.69 144.66,73.69 143.01,75.34 v143.01,75.4 | v191.92,103.89 U$15.2 | v133.13,88.27 133.13,85.27 v133.66,84.75
  Bottom 0.254: v109.78,123.42 109.34,122.98 90.48,122.98 v90.28,123.18 | v111.89,123.02 113.45,121.45 113.8,121.45 116.24,119.01 119.76,119.01 123.11,115.66 123.11,110.79 126.2,107.69 126.2,101.58 128.69,99.09 v129.11,99.09 | v133.13,88.27 133.13,92.07 131.19,94.02 v131.19,99.97 | v162.7,82.31 164.48,84.09 171.05,84.09 171.7,83.45 174.16,83.45 177.51,86.79 189.51,86.79 191.52,88.8 191.52,103.49 v191.92,103.89 | v143.01,75.4 141.3,77.11 141.24,77.11 140.72,77.63 140.72,77.69 v133.66,84.75
FR_CS  (via drill 0.51)
  Top 0.254: M2C1.1 121.51,128.09 M2R8.1 121.31,128.2 v120.41,129.09 | v118.59,130.61 113.67,130.61 111.84,132.44 109.5,132.44 103.33,138.61 v102.33,138.61
  Bottom 0.254: v120.41,129.09 118.89,130.61 v118.59,130.61 | U$2.15 100.56,139.84 101.8,138.61 v102.33,138.61
FR_DIR  (via drill 0.51)
  Top 0.254: v85.61,117.59 MU1.3 | v127.01,135.69 127.11,135.69 M2R5.1 129.18,134.8 130.28,133.69 130.28,133.42 v131.11,132.59 | v142.81,127.49 147.3,127.49 v148.4,126.39 | v150.76,124.89 150.96,124.69 160.31,124.69 v179.01,105.99 | v117.03,120.92 115.53,120.92 v113.94,119.32 | v180.92,105.6 183.51,105.6 v183.62,105.71
  Bottom 0.254: v85.61,117.59 85.89,117.59 87.2,118.9 113.52,118.9 v113.94,119.32 | v127.01,135.69 127.11,135.69 130.21,132.59 130.21,124.39 127.9,122.08 124.04,122.08 122.87,120.92 v117.03,120.92 | v131.11,132.59 137.71,132.59 v142.81,127.49 | v148.4,126.39 149.26,126.39 v150.76,124.89 | v180.92,105.6 179.4,105.6 v179.01,105.99 | U$15.3 185.91,102.1 187.18,103.37 187.18,105.92 186.53,106.56 184.88,106.56 184.02,105.71 v183.62,105.71
FR_OUTA
  Top 0.254: M2J1.+ 157.23,108.19 M2D1.C M2D2.A | M_FR.P1 139.51,125.69 M_FR.P$4 M_FR.SLUG2 | M_FR.SLUG2 M_FR.P$5 | M_FR.SLUG2 M_FR.P$3 | M_FR.SLUG2 M_FR.P$6 | M_FR.SLUG2 | M_FR.SLUG2 M_FR.P$2 | M_FR.SLUG2 M_FR.P$9 | M_FR.SLUG2 M_FR.P$8 | M_FR.SLUG2 M_FR.P$7
  pour Top: 156.21,106.29 156.21,112.59 154.01,114.79 150.71,114.79 146.81,118.69 146.81,120.79 140.81,126.79 140.61,126.79 135.01,121.19 135.01,120.99 144.08,111.92 147.18,111.92 152.81,106.29
FR_OUTB  (via drill 0.51)
  Top 0.254: M2R12.2 159.89,104.72 159.89,103.62 158.96,102.69 157.86,102.69 157.35,103.19 M2J1.- | M_FR.P15 124.21,121.19 v124.41,121.19 | M_FR.P$10 M_FR.P$13 | M_FR.P$10 | M_FR.P$10 M_FR.P$14 | M_FR.P$10 M_FR.P$15 | M_FR.P$10 M_FR.P$11 | M_FR.P$10 M_FR.P$18 | M_FR.P$10 M_FR.P$17 | M_FR.P$10 M_FR.P$16 | M_FR.P$10 M_FR.P$12 | M_FR.P$12
  Bottom 0.254: v124.41,121.19 129.81,115.79 M_FR.P$15
  pour Top: 156.21,100.79 156.21,105.69 152.51,105.69 147.3,110.9 143.62,110.9 134.11,120.41 129.21,115.51 129.21,114.12 142.54,100.79
FR_PWM  (via drill 0.51)
  Top 0.254: M2R7.1 122.31,131.69 M2R11.2 121.71,131.29 v120.51,131.29 | v128.48,124.22 128.63,124.22 v131.41,127 | v140.26,101.63 140.24,101.65 136,101.65 v132.1,105.56 | v135.66,91.42 136.07,91.83 163.08,91.83 v165.19,89.72 | v173.27,88.84 176.41,91.98 v176.41,96.49
  Bottom 0.254: v120.51,131.29 127.58,124.22 v128.48,124.22 | v131.41,127 132.73,125.68 133.55,125.68 136.72,122.51 136.72,114.7 132.1,110.08 v132.1,105.56 | v173.27,88.84 173.24,88.81 169.67,88.81 169.46,88.6 166.31,88.6 v165.19,89.72 | v135.66,91.42 140.26,96.02 v140.26,101.63 | v176.41,96.49 176.81,96.89 183.99,96.89 184.64,97.54 189.27,97.54 190.12,98.39 190.12,100.24 189,101.35 U$15.4
GND  (via drill 0.51)
  Top 0.254: M1R9.1 75.61,127.1 M1R11.1 77.91,129.39 v77.91,130.08 78.08,129.91 80.1,129.91 81.31,128.7 81.31,126.84 3C1.2 83.76,124.19 84.82,123.12 85.23,123.12 87.25,121.1 87.25,120.08 86.08,118.91 83.82,118.91 82.91,117.99 MU1.2 | M2R9.1 M2R11.1 122.91,132.9 v121.61,134.21 | M3R9.1 71.71,61.89 M3R11.1 72.91,60.79 v74.01,59.69 | M4R10.1 121.91,64.09 M4R11.1 v119.9,62.09 121.14,60.85 122.76,60.85 v122.91,60.99 v122.91,61 124,62.09 M4C1.2 | v44.71,68.59 46.01,69.89 v47.01,69.89 | v120.71,39.09 118.3,41.51 118.3,44.36 117.78,44.88 115.8,44.88 113.41,47.28 v113.41,54.11 | v78.51,44.49 81.21,47.19 v81.21,49.19 | 2C3.2 v86.6,55.24 | v86.6,55.24 v86.61,55.25 | 3C2.2 86.6,58.75 v86.6,55.24 | MU2.2 v82.91,57.19 | v73.28,151.02 75.81,148.49 v75.81,140.49 | M3R10.1 75.01,63.19 v75.41,63.19 75.7,62.91 76.58,62.91 77.5,63.83 77.5,65.06 76.11,66.45 M3C1.2 | v82.11,51.09 79.12,54.08 79.12,55.96 79.64,56.48 80.38,56.48 80.48,56.38 v81.01,56.38 | v82.79,53.67 82.79,53.07 v84.39,51.47 | v93.31,145.69 v93.31,147.53 | M2C1.2 120.11,127.1 v119.21,127.99 119.52,128.31 119.52,129.46 120.04,129.98 120.78,129.98 121.46,129.3 M2R10.1 | v116.78,122.22 117.08,122.22 118.02,121.28 118.02,110.39 122.01,106.41 122.01,104.79 120.57,103.35 MOUSE.2 | M1C1.2 71.11,132.74 71.8,133.43 71.8,136.31 v70.71,137.39 | v117.81,61.39 115.25,61.39 114.42,60.56 114.42,56.08 v116.51,53.99 | v88.91,139.29 87.82,139.29 v86.63,140.49 | v136.91,58.06 136.21,57.35 136.21,56.06 134.04,53.89 130.97,53.89 128.46,56.39 v126.61,56.39 | v142.69,63.65 v142.7,63.65 144.94,61.4 147.52,61.4 v150.81,64.69 | v95.61,134.66 96.71,134.66 97.3,135.24 v99.56,135.24
  Top 0.254: v76.01,131.98 v76,131.98 M1R10.1 | v118.59,131.88 117.99,131.88 117.41,131.29 116.34,131.29 115.82,131.81 115.82,132.55 116.34,133.07 116.38,133.07 v117.91,134.59 | C6.1 C7.1 167.11,98.93 166.28,99.76 166.28,101.13 167.11,101.96 v167.11,102.09 | v106.4,149.09 103.33,149.09 v103.15,149.27 | M_FL.P18 M_FL.P19 M_FL.P20 53.87,117.59 v54.01,117.59 | v58.11,113.49 58.11,113.35 M_FL.P26 M_FL.P27 M_FL.P28 57.71,110.12 v57.71,108.99 | M_BL.P28 M_BL.P27 M_BL.P26 54.06,78 v54.22,78 | M_BL.P20 58.2,82.34 v58.2,82.19 | M3C3.2 68.51,94.79 v68.11,94.79 68.11,100.89 v67.71,101.29 68.81,101.29 M1C3.2 | v59.9,83.69 59.68,83.69 M_BL.P18 M_BL.P19 | U1.9 15.27,100.16 U1.6 | v118.69,65.47 119.71,66.48 M4R9.1 | v70.81,38.59 69.94,37.73 v66.54,37.73 | v61.34,34.92 1C7.C
  Top 1.016: M1C2.2 31.74,108.13 37.77,114.16 50.28,114.16 v50.31,114.19
  Bottom 0.254: LC6.2 v44.71,68.59 | C2.2 C3.2 C1.2 95.7,134.66 v95.61,134.66 | LC4.2 121.66,39.09 v120.71,39.09 | v113.41,54.11 114.54,54.11 MUX_L2.12 114.91,53.99 v116.51,53.99 119.52,50.98 119.52,45.73 121.34,43.91 122.73,43.91 123.04,44.05 124.15,45.16 124.15,45.71 2C2.2 124.73,45.82 v125.31,46.39 | v118.69,65.47 117.81,64.58 v117.81,61.39 119.21,61.39 v119.9,62.09 | LC5.2 74.48,38.49 73.65,37.66 71.74,37.66 v70.81,38.59 | 2R3.1 75.21,44.49 v78.51,44.49 | v81.21,49.19 81.21,50.12 MUX_L3.12 81.94,50.93 v82.11,51.09 84.01,51.09 v84.39,51.47 | 2C1.2 72.74,151.02 v73.28,151.02 | v75.81,140.49 75.98,140.32 MUX_L1.12 81.71,140.32 82.43,139.6 84.56,139.6 85.45,140.49 v86.63,140.49 | v75.41,63.19 75.41,61.09 v74.01,59.69 75.25,59.69 78.14,62.58 78.88,62.58 79.4,62.06 79.4,58.71 80.91,57.19 v82.91,57.19 82.1,56.38 v81.01,56.38 | v86.61,55.25 85.03,53.67 v82.79,53.67 | v93.31,145.69 93.26,145.64 C8.2 93.06,144.39 92.15,143.48 91.34,143.48 90.92,143.06 90.92,142.13 91.25,141.8 91.25,141.18 FB2.1 89.36,139.29 v88.91,139.29 | R7.1 98.51,149.37 97.77,150.11 95.21,150.11 93.31,148.21 v93.31,147.53 93.31,149.04 94.2,149.93 94.2,152.76 LR1.2 | v116.78,122.22 119.21,124.65 v119.21,127.99 117.7,129.5 117.7,130.99 v118.59,131.88 | 2R1.1 70.66,137.44 v70.71,137.39 | v121.61,134.21 120.17,135.64 119.21,135.64 | v126.61,56.39 125.2,57.81 125.2,60.05 124.68,60.57 123.33,60.57 v122.91,60.99 | v136.91,58.06 142.5,63.65 v142.69,63.65 | LC3.2 150.86,64.74 v150.81,64.69 | U$2.47 100.06,134.74 v99.56,135.24 105.56,135.24 105.96,135.64 U$2.35 119.21,135.64 | v77.91,130.08 v76.01,131.98
  Bottom 0.254: 119.21,135.64 118.16,134.59 v117.91,134.59 | U$2.23 104.56,143.77 106.06,145.27 106.06,148.75 v106.4,149.09 | v103.15,149.27 104.11,148.31 D1.C | v54.01,117.59 v58.11,113.49 | v58.2,82.19 58.2,81.99 v54.22,78 | v68.11,94.79 68.11,91.9 v59.9,83.69 | v67.71,101.29 65.41,101.29 v57.71,108.99 | v66.54,37.73 63.74,34.92 v61.34,34.92
  Bottom 1.016: v50.31,114.19 53.71,117.59 v54.01,117.59
  other vias: 95.91,19.89 97.91,19.89 99.91,19.89 179.71,111.39 169.11,101.89 173.01,101.19 170.71,104.09 173.51,105.29 174.81,104.39 101.01,149.43
  pour Top (isolate 0.254, rank 2): -17.29,208.19 228.11,208.19 228.11,-12.31 -17.29,-12.31
  pour Bottom (isolate 0.254, rank 2): -17.29,208.19 228.11,208.19 228.11,-12.31 -17.29,-12.31
GND_M  (via drill 0.51)
  Top 0.254: M_FR.P28 M_FR.P27 M_FR.P26 141.95,117.59 v141.51,117.59 | v137.61,113.69 137.61,113.45 M_FR.P20 M_FR.P19 M_FR.P18 | M_BR.P18 M_BR.P19 M_BR.P20 141.75,77.99 v141.61,77.99 | M_BR.P28 M_BR.P27 M_BR.P26 138.72,83.29 v137.57,82.14 | v128.41,101.89 128.31,101.99 M2C3.2 M4C3.2 127.01,94.49 v127.91,94.49 | v147.51,90.29 145.31,90.29 140.21,85.19 | v163.51,108.79 163.51,104.85 160.25,101.59 156.9,101.59 v156.88,101.57 | 140.21,85.19 v140.21,85.09 | v156.31,94.59 165.01,94.59 166.71,92.89 172.31,92.89 GND_M4A.P$1 | v131.3,89.26 131.37,89.18 136.22,89.18 140.21,85.19
  Top 1.016: M4C2.2 170.45,87.96 170.45,91.04 GND_M4A.P$1 | M2C2.2 166.48,111.79 GND_M2A.P$1
  Bottom 0.254: v141.51,117.59 v137.61,113.69 133.07,109.15 133.07,104.35 130.61,101.89 v128.41,101.89 | v141.61,77.99 137.57,82.04 v137.57,82.14 137.57,82.45 v140.21,85.09 | v131.3,89.26 131.3,91.11 v127.91,94.49 | v147.51,90.29 148.61,90.29 152.92,94.6 | GND_M2A.P$1 164.01,109.29 v163.51,108.79 | 152.92,94.6 156.88,98.57 v156.88,101.57 | v156.31,94.59 v156.3,94.6 152.92,94.6
LG_SIG  (via drill 0.51)
  Top 0.254: v109.11,154.49 126.55,154.49 142.59,170.53 142.59,173.15 141.31,174.43 LDR.2 139.1,174.43 LG_R2.2 | v101.88,148.04 101.83,148.09 99.29,148.09 98.11,146.91 v98.11,143.49
  Bottom 0.254: U$2.13 98.72,143.49 v98.11,143.49 | v101.88,148.04 101.88,148.54 102.26,148.93 102.26,149.64 102.78,150.16 103.92,150.16 105.86,152.1 106.02,152.1 108.41,154.49 v109.11,154.49
LIGHT_INT  (via drill 0.51)
  Top 0.254: v134.5,91.98 134.87,92.35 163.81,92.35 166.09,90.08 166.09,89.18 168.87,86.4 171.42,86.4 172.42,87.39 v176.21,87.39
  Bottom 0.254: v134.5,91.98 134.5,100.68 147.31,113.49 147.31,128.18 145.76,129.73 145.76,132.59 144.71,133.64 140.46,133.64 136.41,137.69 136.41,139.69 134.11,141.99 125.45,141.99 122.1,138.64 U$2.29 | U$15.10 187.18,92.46 184.28,92.46 183.95,92.79 179.1,92.79 176.21,89.9 v176.21,87.39
LS0  (via drill 0.51)
  Top 0.254: v110.61,51.93 110.61,56.11 v110.11,56.61 110.11,59.79 v111.51,61.19 | v113.71,63.19 113.71,66.49 v111.95,68.25 | v115.91,125.79 114.44,127.26 v114.44,129.69 | v114.61,131.5 114.61,137.21 v110.37,141.45 | v83.01,140.99 84.51,142.5 v90.03,142.5 | v91.95,144.64 92.41,144.64 92.94,144.11 93.68,144.11 94.2,144.63 94.2,147.26 94.66,147.72 97.99,147.72 v99.44,149.17 | v107.66,149.41 107.66,148.97 105.8,147.12 v99.89,147.12
  Bottom 0.254: U$2.25 107.07,141.64 | 107.07,141.64 v107.01,141.69 107.01,142.82 107.3,143.1 107.3,143.89 106.58,144.61 106.58,147.89 107.66,148.97 v107.66,149.41 | MUX_L1.10 82.38,141.62 v83.01,140.99 | MUX_L3.10 84.64,57.01 109.71,57.01 v110.11,56.61 | v110.61,51.93 111.25,52.57 MUX_L2.10 | v111.51,61.19 113.51,63.19 v113.71,63.19 | v111.95,68.25 114.16,70.46 115.96,70.46 132.21,86.71 132.21,91.51 130.51,93.21 130.51,99.39 129.51,100.39 128.11,100.39 126.71,101.79 126.71,110.59 124.95,112.35 124.95,115.25 120.18,120.03 116.66,120.03 115.88,120.81 115.88,125.77 v115.91,125.79 | v114.44,129.69 114.44,131.33 v114.61,131.5 | v110.37,141.45 107.25,141.45 107.07,141.64 | v90.03,142.5 90.41,142.88 90.41,143.47 90.93,143.99 91.3,143.99 v91.95,144.64 | v99.89,147.12 99.89,148.73 v99.44,149.17
LS1  (via drill 0.51)
  Top 0.254: v89.68,56.12 89.68,56.82 v87.5,58.99 | v83.11,115.79 83.82,116.51 85.78,116.51 91.73,122.46 v91.73,131.97 91.56,132.15 91.56,132.39 90.7,132.39 88.99,134.09 84.71,134.09 84.22,134.59 v84.22,140.51 | v104.91,140.19 102.67,140.19 101.86,139.39 100.61,139.39 100.35,139.13 98.67,139.13 97.22,137.67 95.84,137.67 93.57,135.4 93.57,132.63 v93.74,132.47
  Bottom 0.254: MUX_L1.11 81.78,140.97 82.64,140.11 83.82,140.11 v84.22,140.51 | MUX_L2.11 108.41,53.22 105.21,56.42 89.98,56.42 v89.68,56.12 88.73,56.12 85.4,52.78 81.33,52.78 MUX_L3.11 | v87.5,58.99 83.2,58.99 78.01,64.19 78.01,111.79 82.01,115.79 v83.11,115.79 | v93.74,132.47 92.22,132.47 v91.73,131.97 | v104.91,140.19 104.97,140.14 U$2.26
LS2  (via drill 0.51)
  Top 0.254: v102.08,51.52 105.55,55 v108.7,55 108.7,59.57 v109.11,59.98 | v79.51,137.65 82.71,134.45 v82.71,134.39 | v108.91,140.29 106.07,140.29 105.08,141.28 100.39,141.28 99.25,140.14 98.25,140.14 96.8,138.69 95.42,138.69 92.55,135.82 92.55,134.29 91.55,133.29 v91.11,133.29 90.71,133.29 88.81,135.19 v87.31,135.19 | v105.98,63.67 114.04,71.72 114.04,108.02 115.31,109.29 115.31,110.04 99.45,125.89 v99.31,125.89 | v119.44,53.19 117.22,55.42 v117.22,55.89
  Bottom 0.254: MUX_L3.14 74.98,46.26 75.44,46.72 85.38,46.72 86.89,45.2 91.11,45.2 94.69,48.78 99.34,48.78 v102.08,51.52 | v108.7,55 111.78,55 v112.24,55.46 112.52,55.73 112.52,56.72 113.2,57.4 115.71,57.4 v117.22,55.89 | MUX_L1.14 70.4,140.85 71.05,140.85 74.24,137.65 v79.51,137.65 | v82.71,134.39 86.51,134.39 v87.31,135.19 | v108.91,140.29 108.24,139.63 107.07,139.63 U$2.27 | v109.11,59.98 105.98,63.12 v105.98,63.67 | v99.31,125.89 95.1,130.11 94.05,130.11 93.98,130.18 92.14,130.18 90.81,131.51 90.81,132.99 v91.11,133.29 | v119.44,53.19 122.01,53.19 MUX_L2.14
LS3  (via drill 0.51)
  Top 0.254: v103.71,51.49 106.32,54.11 v109.61,54.11 | v78.61,136.75 81.97,133.39 v83.81,133.39 | v88.52,136.28 88.52,135.87 88.69,135.7 89.02,135.7 90.37,134.35 91.89,134.35 92.04,134.5 92.04,136.03 95.21,139.2 96.59,139.2 98.17,140.78 98.3,140.65 99.04,140.65 100.18,141.79 105.85,141.79 106.64,142.58 107.98,142.58 110.1,140.46 110.1,139.93 v110.48,139.55 | v113.41,56.35 113.41,61.39 v111.26,63.54 | v109.21,64.29 109.21,65.29 v110.51,66.59 | v82.21,113.79 78.51,117.49 v78.51,119.49 | v79.52,128.51 79.52,125.89 v80.41,125
  Bottom 0.254: MUX_L3.13 75.27,45.76 85.24,45.76 86.33,44.67 91.35,44.67 94.92,48.24 100.46,48.24 v103.71,51.49 | v109.61,54.11 112.15,54.11 113.04,55 113.31,55 | 113.31,55 120.91,55 MUX_L2.13 | MUX_L1.13 73.85,136.75 v78.61,136.75 | v88.52,136.28 88.2,135.96 88.2,134.83 86.77,133.39 v83.81,133.39 80.71,130.29 80.71,128.69 80.52,128.51 v79.52,128.51 | U$2.28 110.07,139.14 v110.48,139.55 | 113.31,55 113.31,56.25 v113.41,56.35 | v111.26,63.54 109.96,63.54 v109.21,64.29 | v110.51,66.59 108.61,66.59 96.51,78.69 85.51,78.69 82.76,81.44 82.76,110.56 81.41,111.91 81.41,112.99 v82.21,113.79 | v80.41,125 80.41,121.4 v78.51,119.49
LSIG1  (via drill 0.51)
  Top 0.254: v77.31,148.69 81.81,144.19 v81.81,138.39 | v86.52,139.22 85.92,139.22 85.61,139.53 85.61,141.09 86.11,141.59 87.15,141.59 88.03,140.72 92.01,140.72 92.68,141.39 v94.41,141.39
  Bottom 0.254: MUX_L1.1 77.31,147.69 v77.31,148.69 | v81.81,138.39 81.86,138.44 2R4.2 2C4.1 85.75,138.44 v86.52,139.22 | U$2.10 96.16,139.64 v94.41,141.39
LSIG2  (via drill 0.51)
  Top 0.254: v114.21,44.99 113.51,44.29 102.91,44.29 v97.31,49.89 | v102.01,137.19 102.71,136.49 102.71,135.34 98.12,130.75 98.12,127.75 94.24,123.87 94.24,121.46 88.88,116.11 87.22,116.11 86.44,115.33 85.91,115.33 84.59,114.01 84.59,111.91 v81.33,108.64 | v94.61,62.59 91.11,66.09 91.11,74.71 89.57,76.25 v82.41,76.25 | v94.41,60.19 95.41,59.19 v95.41,55.25
  Bottom 0.254: 2C5.1 2R5.2 115.26,45.43 115.23,45.45 115.23,46.27 MUX_L2.1 114.78,45.57 v114.21,44.99 | U$2.11 99.46,140.14 102.01,137.59 v102.01,137.19 | v94.61,62.59 94.61,60.39 v94.41,60.19 | v95.41,55.25 95.41,51.79 v97.31,49.89 | v82.41,76.25 82.41,80.36 81.74,81.02 81.74,108.23 v81.33,108.64
LSIG3  (via drill 0.51)
  Top 0.254: v78.51,59.09 v80.29,59.09 | v86.91,63.19 86.91,66.54 v80.43,73.02 | v80.16,111.84 77.28,114.72 77.28,118.27 v77.51,118.49 | v90.31,126.69 90.81,126.19 v90.81,124.45 | v94.91,128.99 94.5,129.41 94.5,129.66 93.71,130.45 v93.71,131.19 | v91.1,135.32 91.54,135.76 91.54,136.24 95,139.71 96.38,139.71 97.09,140.42 97.09,141.22 v96.81,141.49
  Bottom 0.254: MUX_L3.1 75.4,55.99 2C6.1 2R6.2 v78.51,59.09 | v80.29,59.09 81.3,58.08 83.28,58.08 83.84,57.52 86.91,57.52 87.49,58.1 87.87,58.1 88.39,58.62 88.39,59.36 86.91,60.84 v86.91,63.19 | v77.51,118.49 77.62,118.61 81.08,118.61 89.12,126.64 90.26,126.64 v90.31,126.69 | v90.81,124.45 94.91,128.55 v94.91,128.99 | U$2.12 96.81,141.39 v96.81,141.49 | v91.1,135.32 92.14,135.32 94.73,132.73 94.73,132.2 94.11,131.58 94.09,131.58 v93.71,131.19 | v80.16,111.84 82.25,109.75 82.25,81.23 83.3,80.19 83.3,75.89 v80.43,73.02
LSWITCH  (via drill 0.51)
  Top 0.254: v127.61,158.79 126.11,157.29 v125.51,157.29 | v68.11,158.49 68.81,158.49 v70.21,157.09 | v159.31,118.19 159.31,118.29 156.9,120.71 v156.9,121.03 | v38,74.39 37.46,74.93 v37.46,77.13 | v157.51,70.99 159.21,72.69 v159.54,72.69 | v160.28,76.12 160.28,77.46 v159.7,78.05 | v36.94,118.66 38.15,119.87 v38.15,120.84
  Top 0.508: v34.37,100.53 33.93,100.09 v30.81,100.09
  Bottom 0.254: LD7.A 71.17,155.35 77.59,155.35 LD8.A 90.45,159.23 LD9.A 95.15,161.15 96.41,159.89 102.18,159.89 LD10.A 104.95,161.15 107.41,158.69 113.81,158.69 LD11.A 118.13,155.45 LD12.A | LD12.A 130.28,149.91 LD13.A 136.81,147.43 136.81,145.39 138.01,144.19 141.41,144.19 LD14.A 144.61,141 144.61,139.22 146.27,137.56 148.08,137.56 149.92,135.72 LD15.A 149.92,130.08 155.27,124.73 LD16.A | LD22.A 149.92,65.52 LD21.A 157.44,71.06 v157.51,70.99 | LD22.A 146.85,58.39 146.12,58.39 142.81,55.09 LD23.A 141.01,51.19 137.71,51.19 134.33,47.82 LD24.A 133.05,44.59 129,44.59 LD25.A | LD25.A 118.13,40.34 LD26.A | LD26.A | LD30.A 76.36,40.34 80.14,36.56 LD29.A 90.45,36.56 LD28.A 94.03,36.29 98.31,36.29 99.97,34.64 LD27.A 105.39,36.58 110.48,36.58 110.5,36.56 LD26.A | LD30.A 65.54,45.88 LD31.A 59.01,48.36 59.01,49.79 55.81,52.99 LD32.A 50.81,55.19 50.81,57.49 46.83,61.47 LD33.A 45.84,61.53 | 45.84,61.53 45.11,62.26 45.11,66.59 40.64,71.06 LD34.A 37.93,73.48 37.93,74.33 v38,74.39 | LD7.A 71.07,154.56 67.11,150.59 62.17,150.59 LD6.A 61.49,148.67 57.41,144.59 54.81,144.59 LD5.A 53.01,140.09 49.91,136.99 47.57,136.99 45.89,135.32 LD4.A 45.89,130.27 LD3.A 40.41,124.68 38.15,122.42 v38.15,120.85 v38.15,120.84 | v70.21,157.09 71.07,156.23 LD7.A | LD30.A 72.92,38.49 LC5.1 | LC3.1 150.54,61.47 LD22.A | v125.51,157.29 124.74,156.53 LD12.A | v159.31,118.19 159.24,118.19 LD17.A 159.24,105.35 LD18.A 161.27,100.65 160.81,100.65 159.42,99.26 159.42,98.37 161.31,96.48 161.31,92.2 LD19.A 161.17,91.25 158.51,88.59 158.51,85.69 159.91,84.29 159.91,82.12 LD20.A 159.7,81.01 v159.7,78.05
  Bottom 0.254: v37.46,77.13 36.94,77.13 36.57,77.5 LD35.A 36.57,90.44 LD36.A 35.25,92.96 35.25,95.44 35.81,95.99 35.81,102.27 LD1.A 34.65,106.48 36.43,108.26 36.43,109.35 35.71,110.07 35.71,113.47 LD2.A 36.57,118.29 v36.94,118.66 | v159.54,72.69 160.28,73.43 v160.28,76.12 | v36.94,118.66 | v68.11,158.49 66.51,158.49 LC1.1 65.51,160.79 59.51,166.79 59.51,171.93 57.61,173.83 LED.2 | v127.61,158.79 128.31,159.5 LC2.1 | LC6.1 47.01,64.34 46.64,63.97 46.64,62.33 45.84,61.53 | LD25.A 124.74,38.68 LC4.1
  Bottom 0.508: LD1.A 34.65,100.81 v34.37,100.53 | v30.81,100.09 29.01,100.09 19.21,90.29 LS1.1
M_SWITCH  (via drill 0.51)